# EasyEDA Pro project EasyEDA Simulation.eprj

# Schematic Schematic1
Board Name: Board1; Create Date: 2026-04-23; Page Name: P1; Project Name: SMP_Project; Schematic Name: Schematic1; Update Date: 2026-04-27; Company: EasyEDA.com; Page Size: A4; Version: V1.0
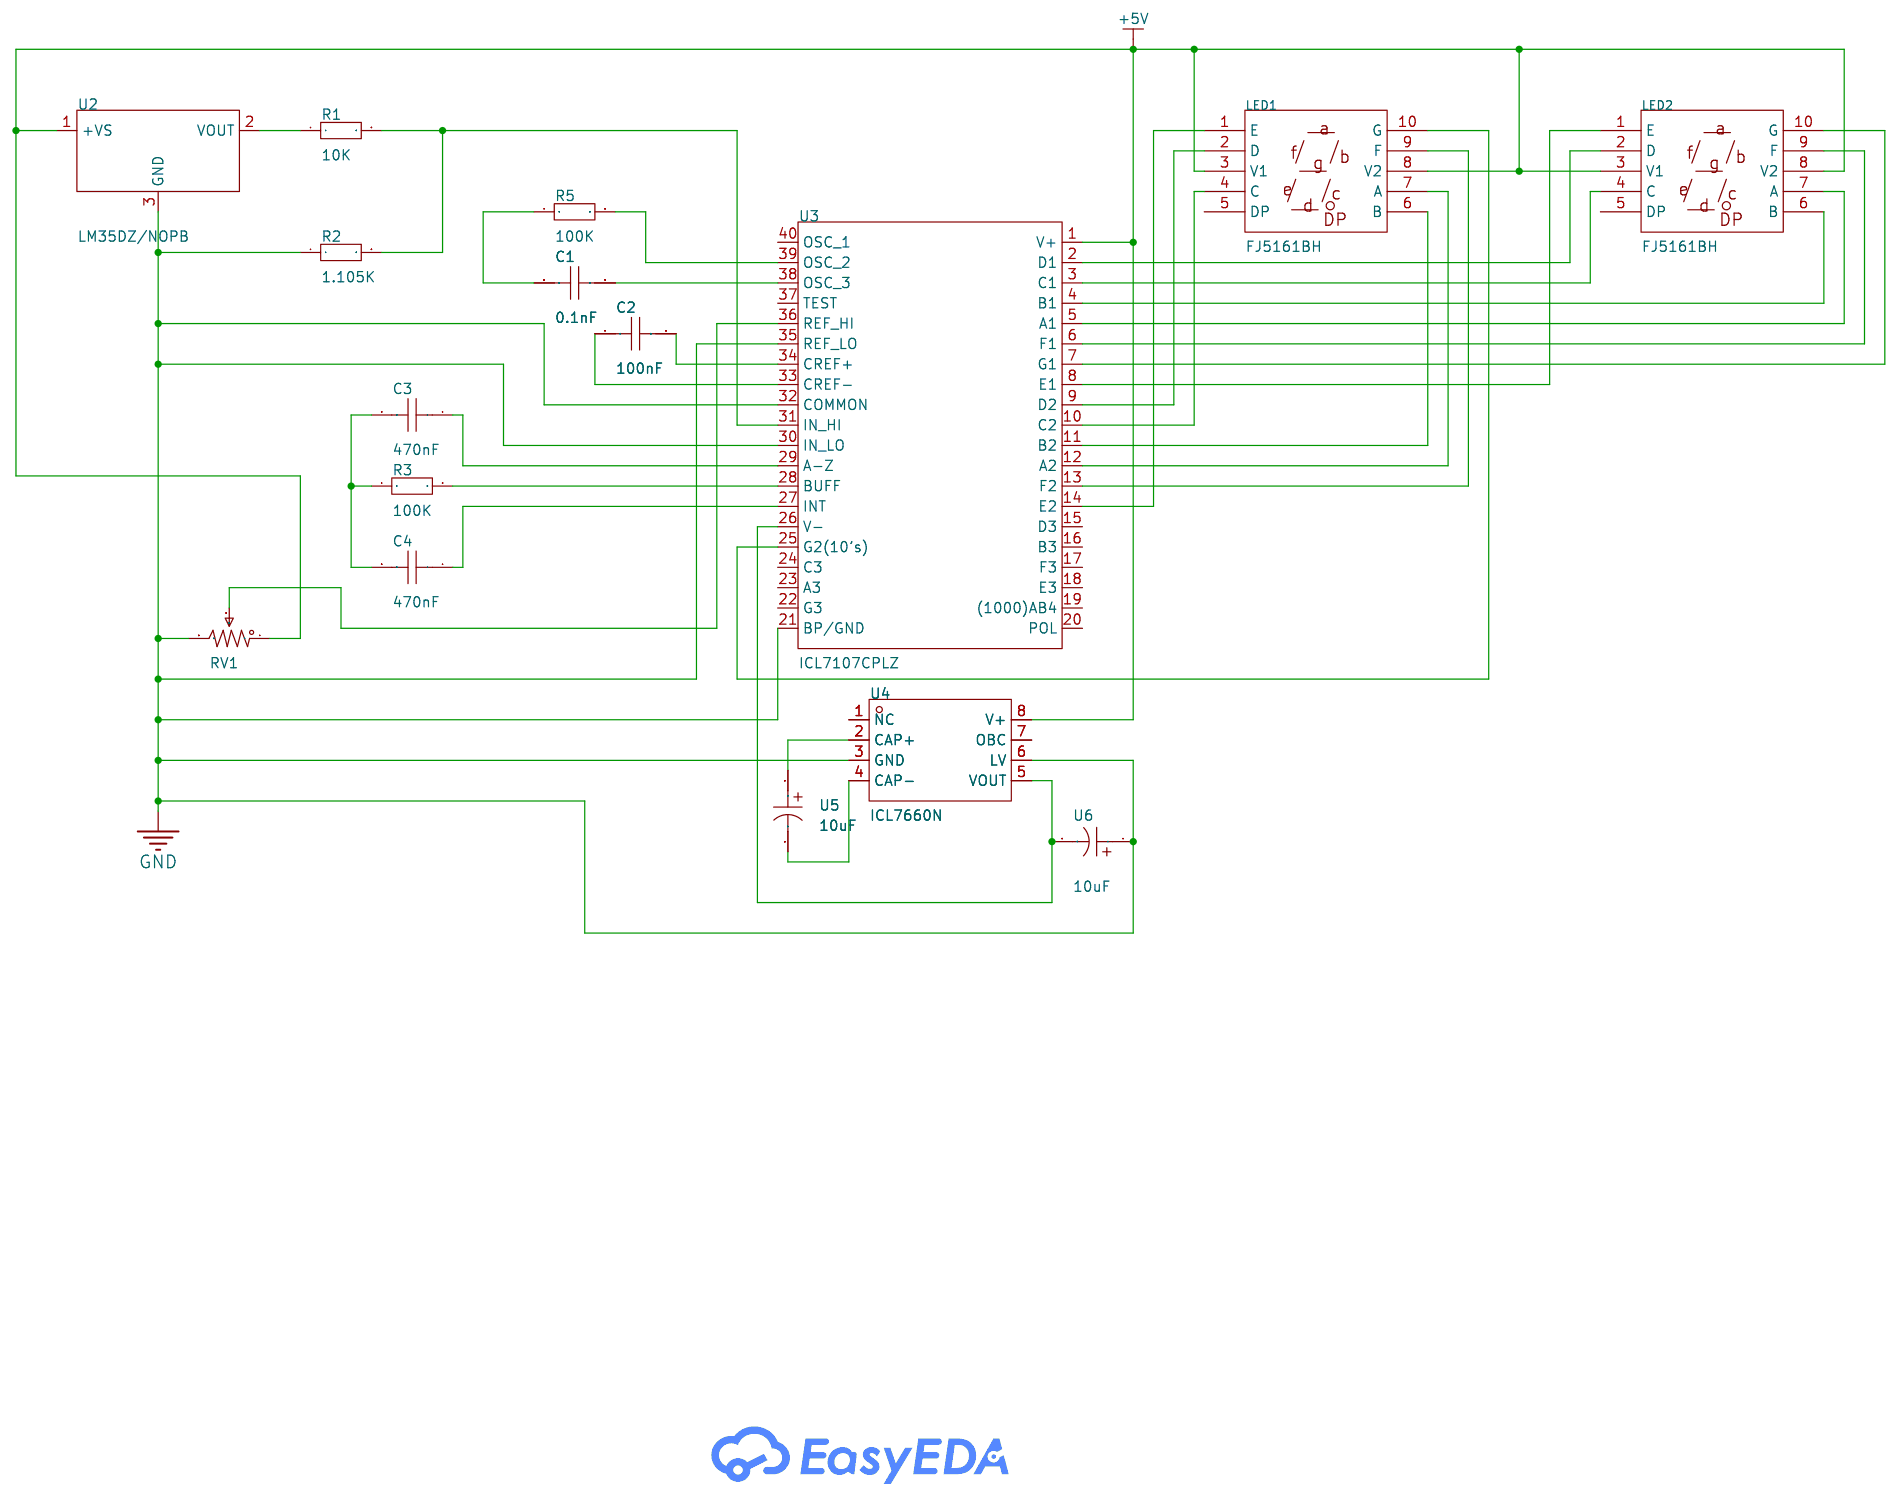
[diagram p0: schematic sheet]

## Parts
C1  0.1nF  [C0805]
C2  100nF  [C0805]
C3  470nF  [C0805]
C4  470nF  [C0805]
LED1  FJ5161BH  [LED-SEG-TH_FJ5161BH]
LED2  FJ5161BH  [LED-SEG-TH_FJ5161BH]
R1  10K  [R0805]
R2  1.105K  [R0805]
R3  100K  [R0805]
R5  100K  [R0805]
RV1  1kΩ  [RES-ADJ-TH_3P-L10.0-W10.0-P2.50-BL-BS]
U2  LM35DZ/NOPB  [TO-92-3_L4.9-W3.7-P1.27-L]
U3  ICL7107CPLZ  [DIP-40_L52.3-W13.9-P2.54-LS15.2-BL]
U4  ICL7660N  [DIP-8_L9.4-W6.4-P2.54-LS9.1-BL]
U5  10uF  [CAP-TH_BD10.0-P5.00-D0.6-FD]
U6  10uF  [CAP-TH_BD10.0-P5.00-D0.6-FD]

## Library data of the parts
C1-C4 = CAP_0805: Supplier Footprint: 0805
LED1 LED2 = FJ5161BH: LCSC Part Name: 1位0.56英寸红色数码管 共阳极; Supplier Part: C8092; Manufacturer: 志浩; Supplier Footprint: 插件; JLCPCB Part Class: Extended Part; Datasheet: https://item.szlcsc.com/datasheet/FJ5161BH/8574.html; Supplier: LCSC; Number of Characters: 1; Display Type: 7 Segment; Digit/Alpha Size(inch): 0.56; Illumination Color: Red; LED Polarity: Common Anode
R1-R3 R5 = Res_0805: Supplier Footprint: 0805
RV1 = 3296W-1-102: LCSC Part Name: 1kΩ ±10%; Supplier Part: C118949; Manufacturer: BOCHEN(博晨); Supplier Footprint: 插件-3P,9.5x4.9mm; JLCPCB Part Class: Extended Part; Datasheet: https://item.szlcsc.com/datasheet/3296W-1-102/120218.html; Supplier: LCSC; Tolerance: ±10%; Power(Watts): 500mW; Temperature Coefficient: ±250ppm/℃; Number of Turns: 30
U2 = LM35DZ/NOPB_C12165: LCSC Part Name: 精密摄氏温度传感器; Supplier Part: C12165; Manufacturer: TI(德州仪器); Supplier Footprint: TO-92; JLCPCB Part Class: Extended Part; Datasheet: https://www.ti.com/cn/lit/gpn/lm35; Supplier: LCSC; Detection Temperature Range: 0℃~+100℃; Tolerance: ±1.5℃; Voltage - Supply: 4V~30V
U3 = ICL7107CPLZ_C1520744: Supplier Part: C1520744; Manufacturer: RENESAS(瑞萨)/IDT; Supplier Footprint: PDIP-40; JLCPCB Part Class: Extended Part; Datasheet: https://item.szlcsc.com/datasheet/ICL7107CPLZ/1611542.html; Supplier: LCSC; Resolution (Bits): 3.5; Voltage - Supply: 6V; Operating Temperature: 0℃~+70℃; Voltage Reference: External；Built-in; Voltage Reference Drift: 1ppm/℃
U4 = ICL7660N: Supplier Part: C19193423; Manufacturer: HGSEMI(华冠); Supplier Footprint: DIP-8; JLCPCB Part Class: Extended Part; Datasheet: https://atta.szlcsc.com/upload/public/pdf/source/20231208/A47A2180530992FCCD2558815FF503B1.pdf; Supplier: LCSC
U5 U6 = 10uF_400V: Supplier Part: C9900016271; Supplier Footprint: Capacitor_THT:CP_Radial_D10.0mm_P5.00mm; JLCPCB Part Class: Extended Part; Supplier: LCSC

## Nets
+5V: LED1.3(V1) LED1.8(V2) LED2.3(V1) LED2.8(V2) RV1.1 U2.1(+VS) U3.1(V+) U4.8(V+)
GND: R2.1 RV1.3 U2.3(GND) U3.21(BP/GND) U3.30(IN LO) U3.32(COMMON) U3.35(REF LO) U4.3(GND) U4.6(LV) U6.1
$1N2817: R1.1 U2.2(VOUT)
$1N4922: C1.2 R5.1
$1N5904: R1.2 R2.2 U3.31(IN HI)
$1N5957: R3.2 U3.28(BUFF)
$1N5960: C4.1 U3.27(INT)
$1N5964: C3.2 C4.2 R3.1
$1N6071: C3.1 U3.29(A-Z)
$1N6088: C2.2 U3.34(CREF+)
$1N6111: C2.1 U3.33(CREF-)
$1N6121: R5.2 U3.39(OSC 2)
$1N6127: C1.1 U3.38(OSC 3)
$1N6316: LED2.7(A) U3.5(A1)
$1N6322: LED2.6(B) U3.4(B1)
$1N6349: LED2.4(C) U3.3(C1)
$1N6356: LED2.2(D) U3.2(D1)
$1N6383: LED2.1(E) U3.8(E1)
$1N6448: LED2.9(F) U3.6(F1)
$1N6454: LED2.10(G) U3.7(G1)
$1N6496: LED1.7(A) U3.12(A2)
$1N6502: LED1.6(B) U3.11(B2)
$1N6516: LED1.4(C) U3.10(C2)
$1N6550: LED1.2(D) U3.9(D2)
$1N6584: LED1.9(F) U3.13(F2)
$1N6616: LED1.1(E) U3.14(E2)
$1N6631: LED1.10(G) U3.25(G2(10’s))
Net-(RV1-2): RV1.2 U3.36(REF HI)
Net-(U3-26): U3.26(V-) U4.5(VOUT) U6.2
Net-(U4-2): U4.2(CAP+) U5.1
Net-(U4-4): U4.4(CAP-) U5.2

Not connected (* = marked no-connect by the designer): LED1 5(DP); LED2 5(DP); U3 15(D3) 16(B3) 17(F3) 18(E3) 19((1000)AB4) 20(POL) 22(G3) 23(A3) 24(C3) 37(TEST) 40(OSC 1); U4 1(NC) 7(OBC)

# Board PCB1
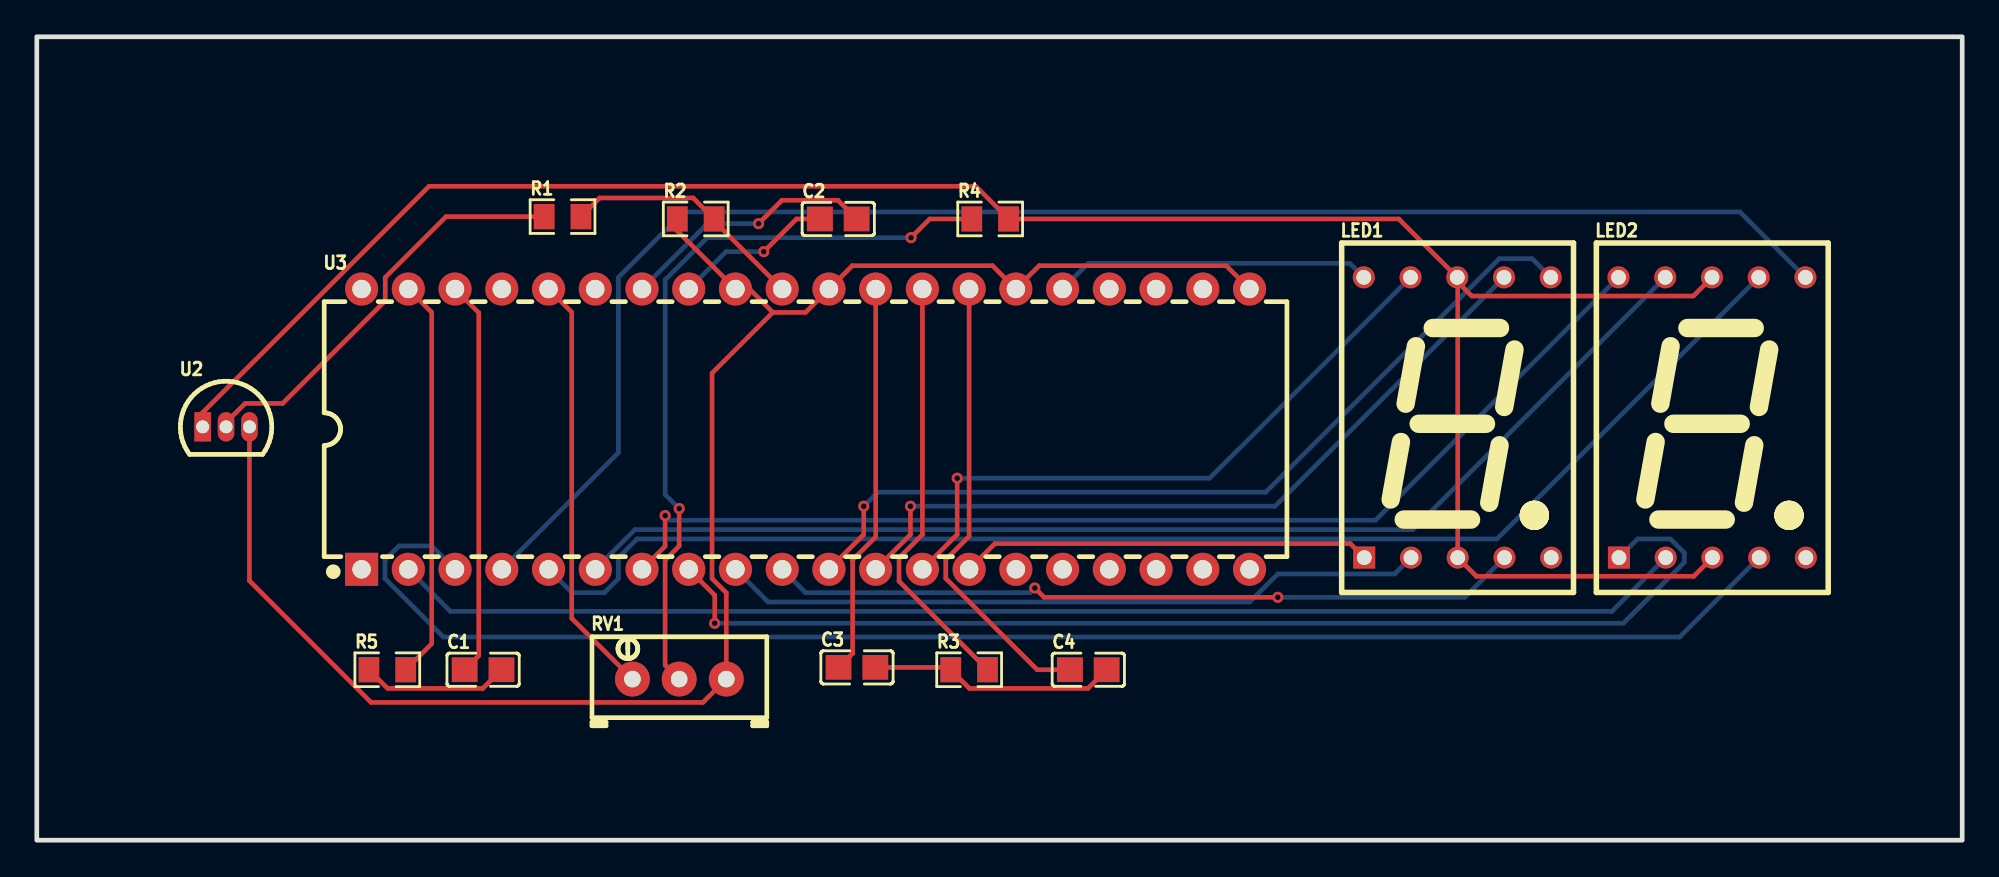
[diagram p1: board, top side]
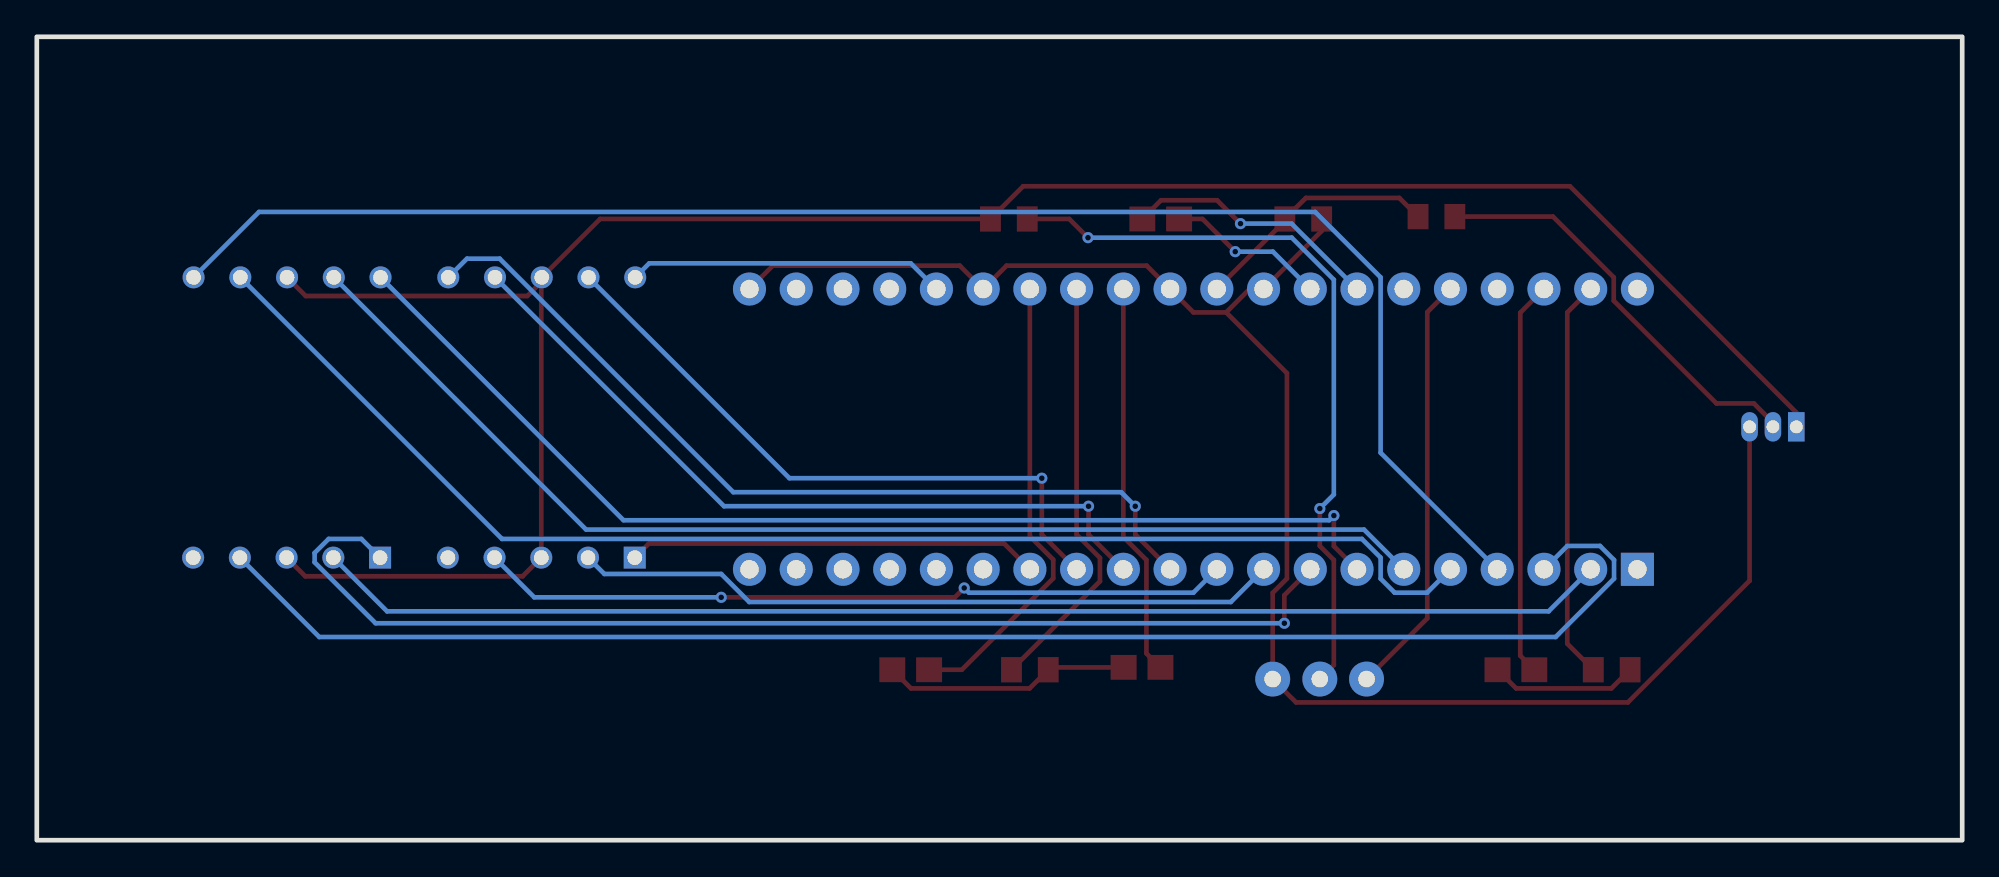
[diagram p2: board, bottom side, seen from below]

Outline 104.65 x 43.69 mm; copper layers: Top Layer, Bottom Layer. Coordinates in mm from the lower left corner of the outline.
Outline path: rectangle 0,43.69 104.65,0
Stack: Top Layer 0.035mm / Dielectric1 1.51mm FR4 er 4.5 / Bottom Layer 0.035mm

## Design rules (mm)
template: JLCPCB Capability(Two Layers Board)
spacing copperThickness1oz (default): track to track 0.102, other pairs 0.152 to 0.3
spacing copperThickness2oz: track to track 0.203, other pairs 0.152 to 0.3
track width copperThickness1oz (default): min 0.127, default 0.254, max 2.54
track width copperThickness2oz: min 0.203, default 0.254, max 2.54
differential pair differentialPair (default): width min 0.127, default 0.254, max 2.54; gap min 0.152, default 0.152
via viaSize (default): diameter min 0.5, default 0.61, max 10; hole min 0.3, default 0.305, max 6.3

## Placement (name value [footprint] x y rotation side)
C1  0.1nF  [C0805]  24.26 9.27 0 top
C2  100nF  [C0805]  43.56 33.78 0 top
C3  470nF  [C0805]  44.58 9.4 0 top
C4  470nF  [C0805]  57.15 9.27 0 top
LED1  FJ5161BH  [LED-SEG-TH_FJ5161BH]  77.22 22.99 0 top
LED2  FJ5161BH  [LED-SEG-TH_FJ5161BH]  91.06 22.99 0 top
R1  10K  [R0805]  28.58 33.91 0 top
R2  1.105K  [R0805]  35.81 33.78 0 top
R3  100K  [R0805]  50.67 9.27 0 top
R4  47K  [R0805]  51.82 33.78 0 top
R5  100K  [R0805]  19.05 9.27 0 top
RV1  1kΩ  [RES-ADJ-TH_3P-L9.5-W4.9-P2.50-L_3296W]  34.92 8.76 0 top
U2  LM35DZ/NOPB  [TO-92-3_L4.9-W3.7-P1.27-L]  10.29 22.48 0 top
U3  ICL7107CPLZ  [DIP-40_L52.3-W13.9-P2.54-LS15.2-BL]  41.78 22.35 0 top

## Footprints (pads in the part's own frame, mm; a bottom-side part is the same pattern mirrored in y, then rotated)
C0805
  rect 1.41x1.35 smd: 1(-1,0) 2(1,0)
DIP-40_L52.3-W13.9-P2.54-LS15.2-BL
  rect 1.8x1.8 hole 1: 1(-24.13,-7.62)
  round 1.8 hole 1: 2(-21.59,-7.62) 3(-19.05,-7.62) 4(-16.51,-7.62) 5(-13.97,-7.62) 6(-11.43,-7.62) 7(-8.89,-7.62) 8(-6.35,-7.62) 9(-3.81,-7.62) 10(-1.27,-7.62) 11(1.27,-7.62) 12(3.81,-7.62) 13(6.35,-7.62) 14(8.89,-7.62) 15(11.43,-7.62) 16(13.97,-7.62) 17(16.51,-7.62) 18(19.05,-7.62) 19(21.59,-7.62) 20(24.13,-7.62) 21(24.13,7.62) 22(21.59,7.62) 23(19.05,7.62) 24(16.51,7.62) 25(13.97,7.62) 26(11.43,7.62) 27(8.89,7.62) 28(6.35,7.62) 29(3.81,7.62) 30(1.27,7.62) 31(-1.27,7.62) 32(-3.81,7.62) 33(-6.35,7.62) 34(-8.89,7.62) 35(-11.43,7.62) 36(-13.97,7.62) 37(-16.51,7.62) 38(-19.05,7.62) 39(-21.59,7.62) 40(-24.13,7.62)
LED-SEG-TH_FJ5161BH
  rect 1.2x1.2 hole 0.8: 1(-5.067,-7.62)
  round 1.2 hole 0.8: 2(-2.527,-7.62) 3(0.013,-7.62) 4(2.553,-7.62) 5(5.093,-7.62) 6(5.067,7.62) 7(2.527,7.62) 8(-0.013,7.62) 9(-2.553,7.62) 10(-5.093,7.62)
R0805
  rect 1.133x1.377 smd: 1(-1,0) 2(1,0)
RES-ADJ-TH_3P-L9.5-W4.9-P2.50-L_3296W
  round 1.9 hole 0.9: 1(-2.55,0) 2(-0.01,0) 3(2.55,0)
TO-92-3_L4.9-W3.7-P1.27-L
  rect 0.9x1.6 hole 0.7: 1(-1.27,0)
  oval 0.9x1.6 hole 0.7: 2(0,0) 3(1.27,0)

## Nets
As in the schematic, except:
+5V: LED1.3 LED1.8 LED2.3 LED2.8 R4.2 U2.1
GND: R2.1 RV1.3 U2.3 U3.21 U3.26 U3.30 U3.32
$1N3445: R4.1 RV1.2
$1N6266: RV1.1 U3.36

Pads without a net: LED1 5; LED2 5; U3 1 15 16 17 18 19 20 22 23 24 35 37 40

## Via types
v1: diameter 0.61, hole 0.305, Top Layer to Bottom Layer, 11 vias

## Routing (per net, layer and track width the routed paths; a pad name or vN(x,y) marks a point on that pad's centre or on a via; arc(x,y) is an arc through that point)
+5V: length 120.6
  Top Layer w0.254: 77.23,30.35 LED1.3 78.24,14.35 90.06,14.35 LED2.3 ; 77.23,30.35 77.99,29.59 90.03,29.59 LED2.8 ; 77.23,30.35 LED1.8 74.03,33.78 R4.2 51.04,35.56 21.32,35.56 9.02,23.26 U2.1
GND: length 95.4
  Top Layer w0.254: 40.01,28.7 38.73,29.97 U3.32 34.81,33.13 R2.1 ; 40.01,28.7 41.78,28.7 U3.30 44.32,31.24 51.94,31.24 U3.26 54.48,31.24 64.64,31.24 U3.21 ; 40.01,28.7 36.7,25.4 36.7,14.22 37.48,13.45 RV1.3 36.2,7.49 18.17,7.49 11.56,14.11 U2.3
$1N2817: length 22.9
  Top Layer w0.254: R1.1 22.24,33.91 18.94,30.61 18.94,29.34 13.35,23.75 11.32,23.75 10.42,22.85 10.42,22.61 U2.2
$1N3445: length 40.7
  Top Layer w0.254: v1(34.92,18.03) 34.92,16 34.15,15.24 34.15,9.52 RV1.2 ; v1(47.51,32.77) 48.53,33.78 R4.1
  Bottom Layer w0.254: v1(34.92,18.03) 34.15,18.8 34.15,30.48 36.44,32.77 v1(47.51,32.77)
$1N4922: length 8
  Top Layer w0.254: C1.2 24.24,8.25 19.07,8.25 R5.1
$1N5904: length 13.5
  Top Layer w0.254: R1.2 30.59,34.92 35.67,34.92 R2.2 36.81,33.67 U3.31
$1N5957: length 23.2
  Top Layer w0.254: R3.2 46.86,14.08 46.86,15.35 48.13,16.62 U3.28
$1N5960: length 25.1
  Top Layer w0.254: C4.1 54.37,9.27 49.4,14.24 49.4,15.26 50.67,16.53 U3.27
$1N5964: length 13.5
  Top Layer w0.254: C3.2 49.55,9.4 R3.1 50.69,8.25 57.13,8.25 C4.2
$1N6071: length 21.4
  Top Layer w0.254: U3.29 45.59,16.49 44.34,15.24 44.34,10.16 C3.1
$1N6088: length 14.1
  Top Layer w0.254: C2.2 43.55,34.8 40.5,34.8 v1(39.23,33.53)
  Bottom Layer w0.254: U3.34 36.45,33.53 v1(39.23,33.53)
$1N6111: length 8.7
  Top Layer w0.254: C2.1 41.29,33.78 v1(39.51,32)
  Bottom Layer w0.254: v1(39.51,32) 37.46,32 U3.33
$1N6121: length 21.8
  Top Layer w0.254: R5.2 21.46,10.68 21.46,28.7 U3.39
$1N6127: length 21.5
  Top Layer w0.254: C1.1 24.02,10.03 24.02,28.69 U3.38
$1N6266: length 23.1
  Top Layer w0.254: RV1.1 29.07,12.06 29.07,28.71 U3.36
$1N6316: length 74.1
  Bottom Layer w0.254: LED2.7 79.36,16.38 32.63,16.38 31.61,15.37 31.61,14.22 30.85,13.46 29.08,13.46 27.81,14.73
$1N6322: length 86
  Bottom Layer w0.254: 25.27,14.73 31.61,21.07 31.61,30.61 35.17,34.16 92.57,34.16 LED2.6
$1N6349: length 83.5
  Bottom Layer w0.254: 22.73,14.73 21.46,16 19.69,16 18.92,15.24 18.92,14.22 22.1,11.05 89.29,11.05 LED2.4
$1N6356: length 70.5
  Bottom Layer w0.254: LED2.2 85.61,12.45 22.48,12.45 20.19,14.73
$1N6383: length 62.4
  Top Layer w0.254: v1(36.84,11.8) 36.84,13.32 35.43,14.73
  Bottom Layer w0.254: LED2.1 87.01,16.38 88.79,16.38 89.55,15.62 89.55,15.11 86.23,11.8 v1(36.84,11.8)
$1N6448: length 64.7
  Bottom Layer w0.254: 30.35,14.73 32.51,16.89 74.79,16.89 LED2.9
$1N6454: length 60.8
  Top Layer w0.254: 32.89,14.73 34.15,15.99 v1(34.15,17.65)
  Bottom Layer w0.254: LED2.10 72.76,17.4 34.4,17.4 v1(34.15,17.65)
$1N6496: length 41.6
  Top Layer w0.254: 45.59,14.73 47.49,16.62 v1(47.49,18.16)
  Bottom Layer w0.254: LED1.7 67.3,18.16 v1(47.49,18.16)
$1N6502: length 47.5
  Top Layer w0.254: 43.05,14.73 44.95,16.62 v1(44.95,18.16)
  Bottom Layer w0.254: LED1.6 81.27,31.62 79.49,31.62 66.79,18.92 45.71,18.92 v1(44.95,18.16)
$1N6516: length 41
  Top Layer w0.254: v1(54.24,13.72) 54.75,13.21 v1(67.45,13.21)
  Bottom Layer w0.254: 40.51,14.73 41.78,13.46 53.99,13.46 v1(54.24,13.72) ; LED1.4 77.61,13.21 v1(67.45,13.21)
$1N6550: length 38.5
  Bottom Layer w0.254: 37.97,14.73 39.75,12.95 65.93,12.95 67.45,14.48 73.8,14.48 LED1.2
$1N6584: length 34.9
  Top Layer w0.254: 48.13,14.73 50.03,16.62 v1(50.03,19.68)
  Bottom Layer w0.254: LED1.9 63.74,19.68 v1(50.03,19.68)
$1N6616: length 22.4
  Top Layer w0.254: 50.67,14.73 52.07,16.13 71.39,16.13 LED1.1
$1N6631: length 17.3
  Bottom Layer w0.254: U3.25 57.15,31.37 71.36,31.37 LED1.10
